# Altium schematic sheet 35-CSI-GPM-CDSS INTERFACE.SchDoc
size 513 x 386 mm
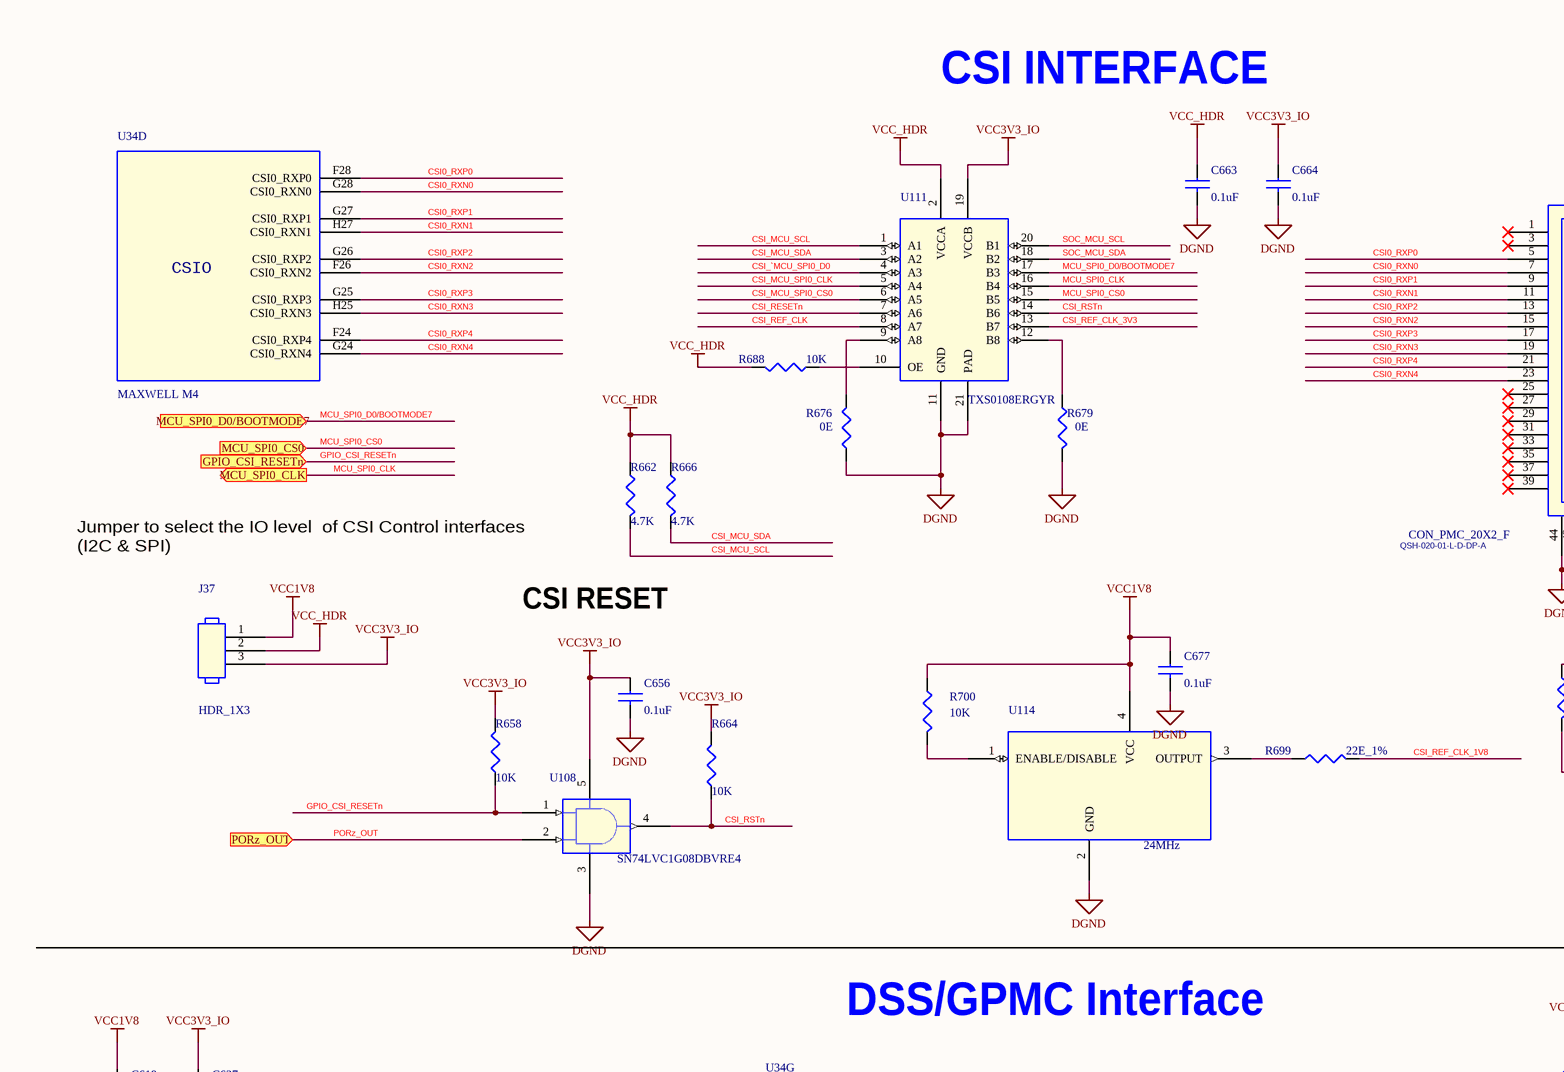
[diagram p0: 35-CSI-GPM-CDSS INTERFACE.SchDoc, top left]
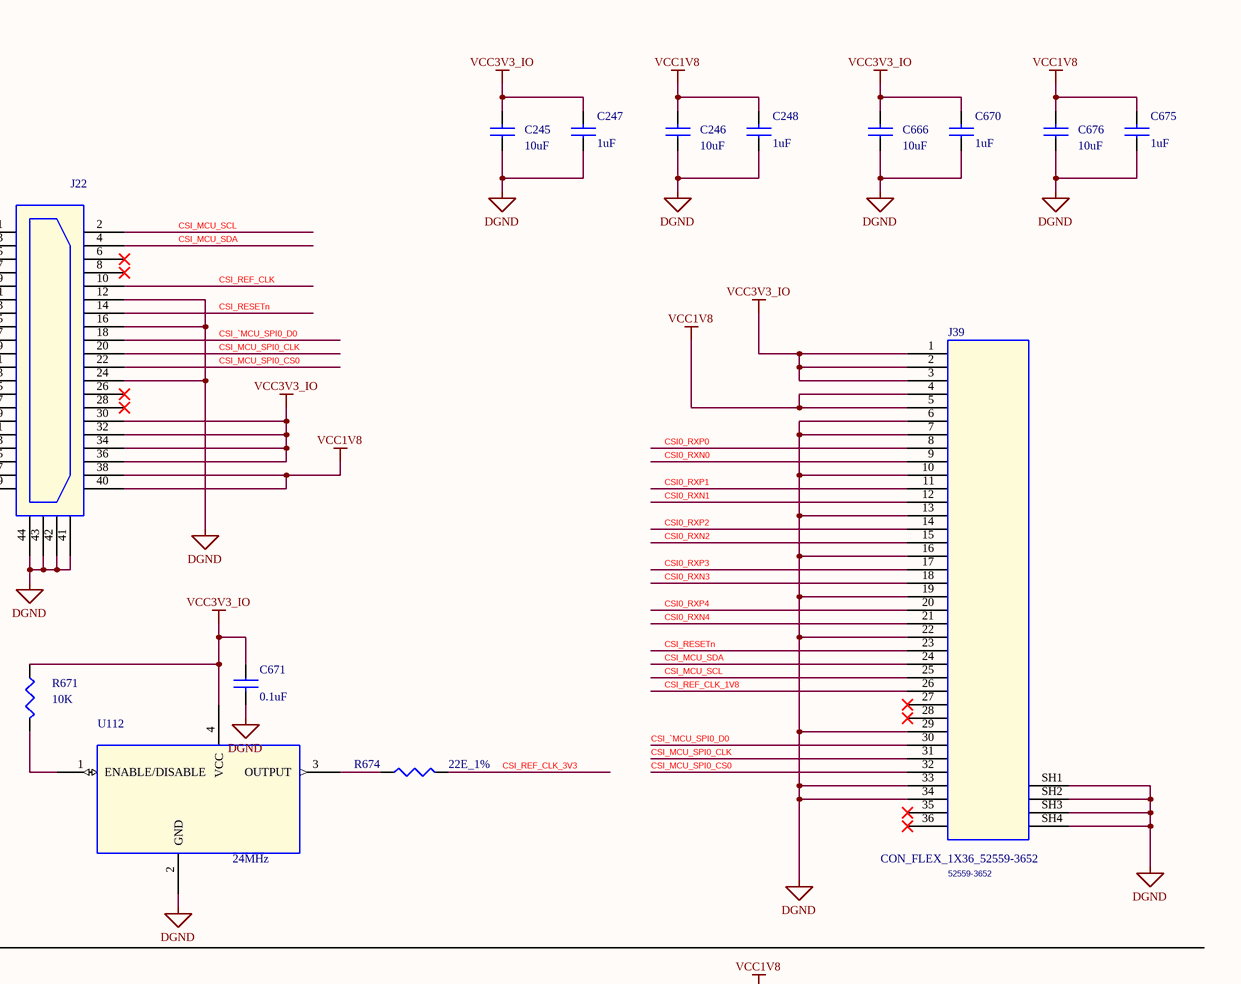
[diagram p1: 35-CSI-GPM-CDSS INTERFACE.SchDoc, top right]
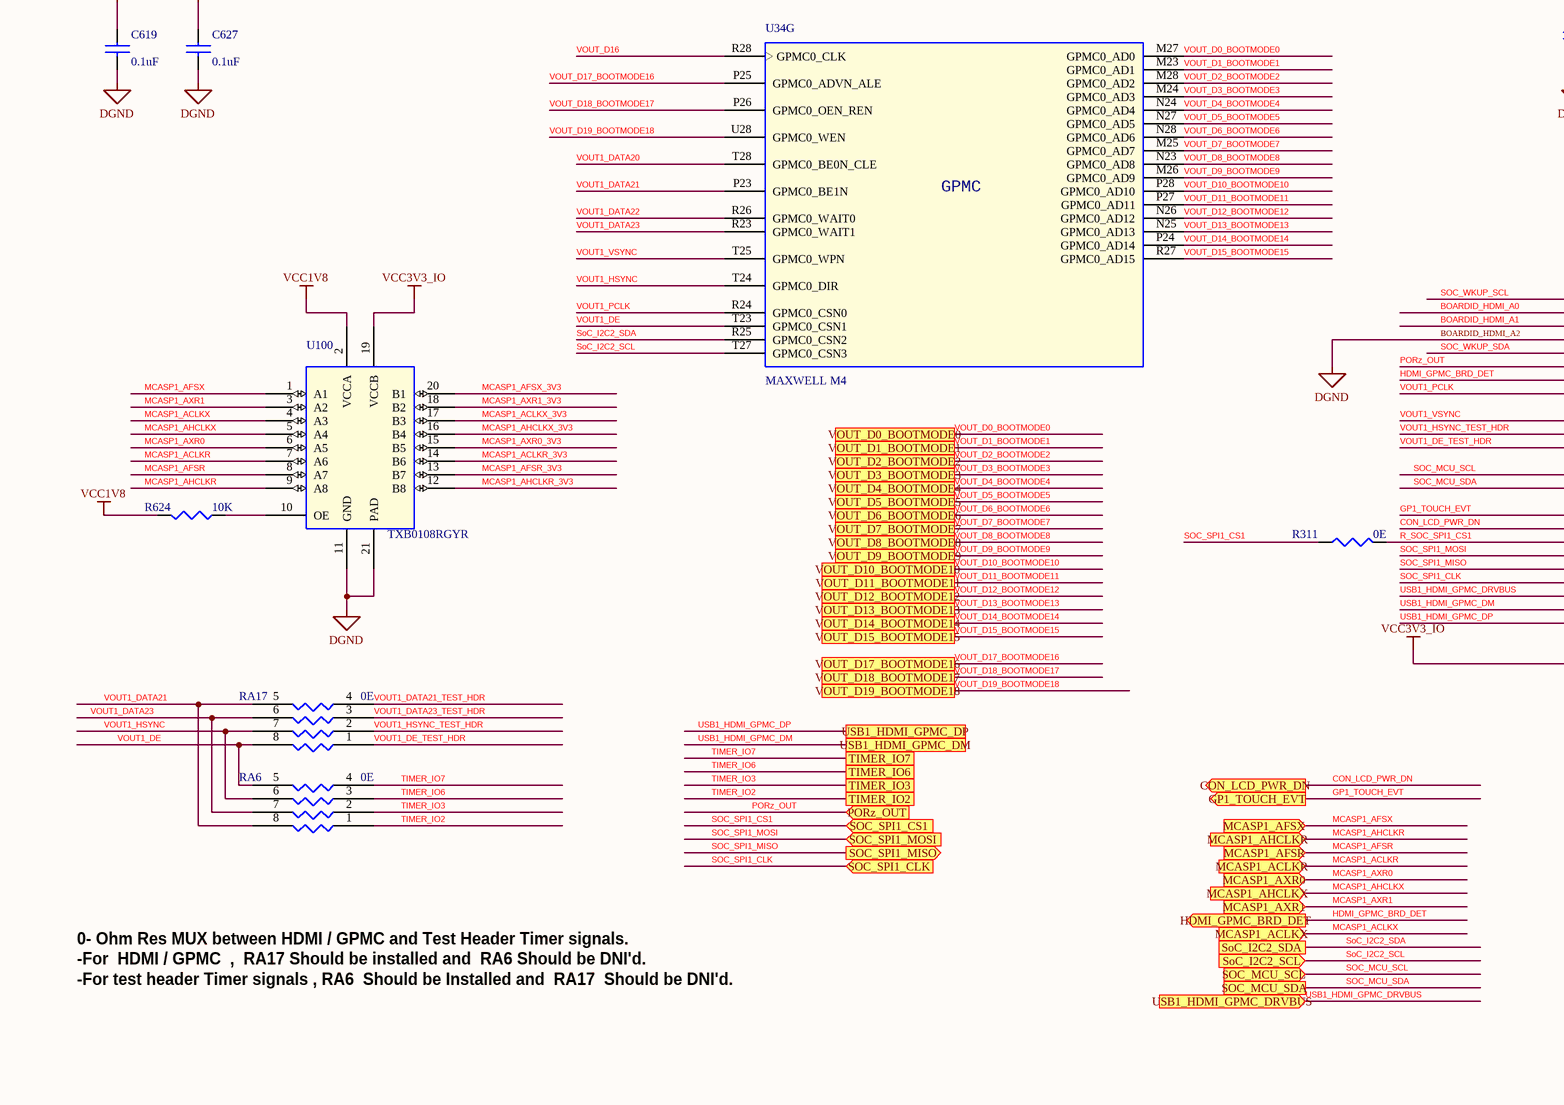
[diagram p2: 35-CSI-GPM-CDSS INTERFACE.SchDoc, bottom left]
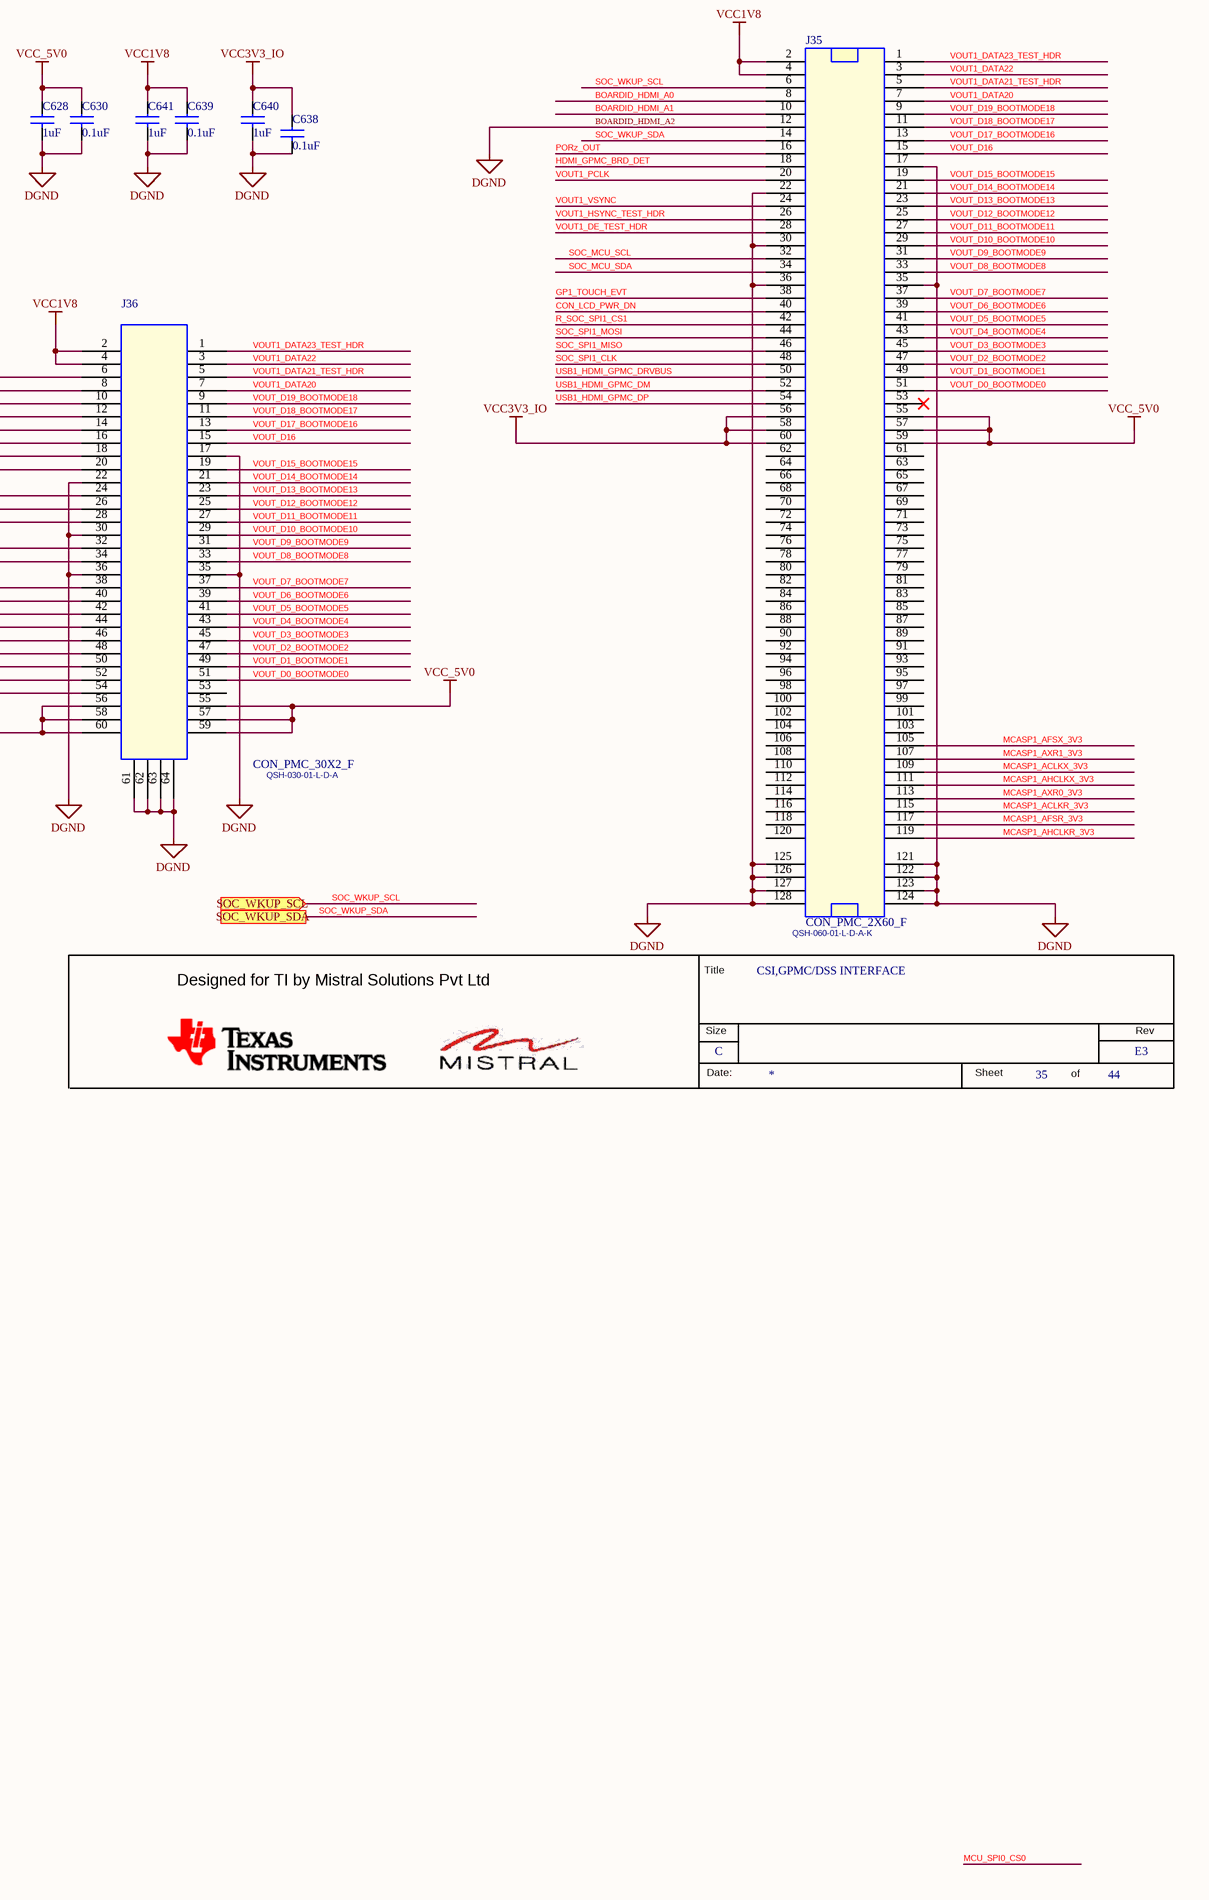
[diagram p3: 35-CSI-GPM-CDSS INTERFACE.SchDoc, bottom right]

## Parts
*  RevCode: E3  Title: CSI,GPMC/DSS INTERFACE  Page Size: C  Page Number: 35  Page Count: 44  (hidden comment: MISTRAL_TITLEBLK_CSIZE)  (graphical)
C245  10uF  [CAP0603_1]
C246  10uF  [CAP0603_1]
C247  1uF  [CAP0402_0-75]
C248  1uF  [CAP0402_0-75]
C619  0.1uF  [CAP0201_0-5]
C627  0.1uF  [CAP0201_0-5]
C628  1uF  [CAP0402_0-75]
C630  0.1uF  [CAP0201_0-5]
C638  0.1uF  [CAP0201_0-5]
C639  0.1uF  [CAP0201_0-5]
C640  1uF  [CAP0402_0-75]
C641  1uF  [CAP0402_0-75]
C656  0.1uF  [CAP0201_0-5]
C663  0.1uF  [CAP0201_0-5]
C664  0.1uF  [CAP0201_0-5]
C666  10uF  [CAP0603_1]
C670  1uF  [CAP0402_0-75]
C671  0.1uF  [CAP0201_0-5]
C675  1uF  [CAP0402_0-75]
C676  10uF  [CAP0603_1]
C677  0.1uF  [CAP0201_0-5]
J22  CON_PMC_20X2_F  Mfr_part_number: QSH-020-01-L-D-DP-A  [CON_PMC20X2_QSH-D-DP_S_S_S]
J35  CON_PMC_2X60_F  Mfr_part_number: QSH-060-01-L-D-A-K  [CON_PMC60X2_HQCD-060_S_S_S_3-3]
J36  CON_PMC_30X2_F  Mfr_part_number: QSH-030-01-L-D-A  [CON_PMC30X2_QSH-030-01-L_S_S_S]
J37  HDR_1X3  [HDR_3X1_100_S_T]
J39  CON_FLEX_1X36_52559-3652  Mfr_part_number: 52559-3652  [CON_FLEX1X36_52559-36_S_S_S_5-3]
R311  0E  [RES0402_0-5]
R624  10K  [RES0402_0-5]
R658  10K  [RES0402_0-5]
R662  4.7K  [RES0402]
R664  10K  [RES0402_0-5]
R666  4.7K  [RES0402]
R671  10K  [RES0402_0-5]
R674  22E_1%  [RES0402]
R676  0E  [RES0402_0-5]
R679  0E  [RES0402_0-5]
R688  10K  [RES0402_0-5]
R699  22E_1%  [RES0402]
R700  10K  [RES0402_0-5]
RA6  0E  [RESA_EXBN8V_0402-4_0-6]
RA17  0E  [RESA_EXBN8V_0402-4_0-6]
U34  MAXWELL M4  [BGA784_31-49_910X910_1-7]  (parts D,G of 19)
U100  TXB0108RGYR  [QFN20_19-68_185X145_1]
U108  SN74LVC1G08DBVRE4  [SOT23-5]
U111  TXS0108ERGYR  [QFN20_19-68_185X145_1]
U112  24MHz  [OSC4_KC2520B_100X80_SMD]
U114  24MHz  [OSC4_KC2520B_100X80_SMD]

## Ports
CON_LCD_PWR_DN (out), GP1_TOUCH_EVT (out), GPIO_CSI_RESETn (in), HDMI_GPMC_BRD_DET (out), MCASP1_ACLKR (in), MCASP1_ACLKX (in), MCASP1_AFSR (in), MCASP1_AFSX (in), MCASP1_AHCLKR (in), MCASP1_AHCLKX (in), MCASP1_AXR0 (in), MCASP1_AXR1 (in), MCU_SPI0_CLK (out), MCU_SPI0_CS0 (in), MCU_SPI0_D0/BOOTMODE7 (in), PORz_OUT (in), SoC_I2C2_SCL (in), SoC_I2C2_SDA, SOC_MCU_SCL (in), SOC_MCU_SDA, SOC_SPI1_CLK (in), SOC_SPI1_CS1 (in), SOC_SPI1_MISO (out), SOC_SPI1_MOSI (in), SOC_WKUP_SCL (in), SOC_WKUP_SDA, TIMER_IO2, TIMER_IO3, TIMER_IO6, TIMER_IO7, USB1_HDMI_GPMC_DM, USB1_HDMI_GPMC_DP, USB1_HDMI_GPMC_DRVBUS (in), VOUT_D0_BOOTMODE0, VOUT_D1_BOOTMODE1, VOUT_D2_BOOTMODE2, VOUT_D3_BOOTMODE3, VOUT_D4_BOOTMODE4, VOUT_D5_BOOTMODE5, VOUT_D6_BOOTMODE6, VOUT_D7_BOOTMODE7, VOUT_D8_BOOTMODE8, VOUT_D9_BOOTMODE9, VOUT_D10_BOOTMODE10, VOUT_D11_BOOTMODE11, VOUT_D12_BOOTMODE12, VOUT_D13_BOOTMODE13, VOUT_D14_BOOTMODE14, VOUT_D15_BOOTMODE15, VOUT_D17_BOOTMODE16, VOUT_D18_BOOTMODE17, VOUT_D19_BOOTMODE18

## Nets
DGND: C245.1 C246.1 C247.1 C248.1 C619.2 C627.2 C628.2 C630.2 C638.2 C639.2 C640.2 C641.2 C656.2 C663.2 C664.2 C666.1 C670.1 C671.2 C675.1 C676.1 C677.2 J22.12 J22.16 J22.24 J22.41(GND1) J22.42(GND2) J22.43(GND3) J22.44(GND4) J35.12 J35.17 J35.22 J35.30 J35.35 J35.36 J35.121 J35.122 J35.123 J35.124 J35.125 J35.126 J35.127 J35.128 J36.12 J36.17 J36.22 J36.30 J36.35 J36.36 J36.61 J36.62 J36.63 J36.64 J39.6 J39.7 J39.10 J39.13 J39.16 J39.19 J39.22 J39.29 J39.33 J39.34 J39.SH1 J39.SH2 J39.SH3 J39.SH4 R676.1 R679.1 U100.11(GND) U100.21(PAD) U108.3(GND) U111.11(GND) U111.21(PAD) U112.2(GND) U114.2(GND)
VCC1V8: C246.2 C248.2 C619.1 C639.1 C641.1 C675.2 C676.2 C677.1 J22.38 J22.40 J35.2 J35.4 J36.2 J36.4 J37.1 J39.4 J39.5 R624.2 R700.1 U100.2(VCCA) U114.4(VCC)
VCC3V3_IO: C245.2 C247.2 C627.1 C638.1 C640.1 C656.1 C664.1 C666.2 C670.2 C671.1 J22.30 J22.32 J22.34 J22.36 J35.56 J35.58 J35.60 J36.56 J36.58 J36.60 J37.3 J39.1 J39.2 J39.3 R658.2 R664.2 R671.1 U100.19(VCCB) U108.5(VCC) U111.19(VCCB) U112.4(VCC)
VCC_5V0: C628.1 C630.1 J35.55 J35.57 J35.59 J36.55 J36.57 J36.59
VCC_HDR: C663.1 J37.2 R662.1 R666.1 R688.2 U111.2(VCCA)
BOARDID_HDMI_A0: J35.8 J36.8
BOARDID_HDMI_A1: J35.10 J36.10
CON_LCD_PWR_DN: J35.40 J36.40 ; port CON_LCD_PWR_DN
CSI0_RXN0: J22.7 J39.9 U34.G28(CSI0_RXN0)
CSI0_RXN1: J22.11 J39.12 U34.H27(CSI0_RXN1)
CSI0_RXN2: J22.15 J39.15 U34.F26(CSI0_RXN2)
CSI0_RXN3: J22.19 J39.18 U34.H25(CSI0_RXN3)
CSI0_RXN4: J22.23 J39.21 U34.G24(CSI0_RXN4)
CSI0_RXP0: J22.5 J39.8 U34.F28(CSI0_RXP0)
CSI0_RXP1: J22.9 J39.11 U34.G27(CSI0_RXP1)
CSI0_RXP2: J22.13 J39.14 U34.G26(CSI0_RXP2)
CSI0_RXP3: J22.17 J39.17 U34.G25(CSI0_RXP3)
CSI0_RXP4: J22.21 J39.20 U34.F24(CSI0_RXP4)
CSI_`MCU_SPI0_D0: J22.18 J39.30 U111.4(A3)
CSI_MCU_SCL: J22.2 J39.25 R662.2 U111.1(A1)
CSI_MCU_SDA: J22.4 J39.24 R666.2 U111.3(A2)
CSI_MCU_SPI0_CLK: J22.20 J39.31 U111.5(A4)
CSI_MCU_SPI0_CS0: J22.22 J39.32 U111.6(A5)
CSI_REF_CLK: J22.10 U111.8(A7)
CSI_REF_CLK_1V8: J39.26 R699.2
CSI_REF_CLK_3V3: R674.2 U111.13(B7)
CSI_RESETn: J22.14 J39.23 U111.7(A6)
CSI_RSTn: R664.1 U108.4(Y) U111.14(B6)
GP1_TOUCH_EVT: J35.38 J36.38 ; port GP1_TOUCH_EVT
GPIO_CSI_RESETn: R658.1 U108.1(A) ; port GPIO_CSI_RESETn
HDMI_GPMC_BRD_DET: J35.18 J36.18 ; port HDMI_GPMC_BRD_DET
MCASP1_ACLKR: U100.7(A6) ; port MCASP1_ACLKR
MCASP1_ACLKR_3V3: J35.115 U100.14(B6)
MCASP1_ACLKX: U100.4(A3) ; port MCASP1_ACLKX
MCASP1_ACLKX_3V3: J35.109 U100.17(B3)
MCASP1_AFSR: U100.8(A7) ; port MCASP1_AFSR
MCASP1_AFSR_3V3: J35.117 U100.13(B7)
MCASP1_AFSX: U100.1(A1) ; port MCASP1_AFSX
MCASP1_AFSX_3V3: J35.105 U100.20(B1)
MCASP1_AHCLKR: U100.9(A8) ; port MCASP1_AHCLKR
MCASP1_AHCLKR_3V3: J35.119 U100.12(B8)
MCASP1_AHCLKX: U100.5(A4) ; port MCASP1_AHCLKX
MCASP1_AHCLKX_3V3: J35.111 U100.16(B4)
MCASP1_AXR0: U100.6(A5) ; port MCASP1_AXR0
MCASP1_AXR0_3V3: J35.113 U100.15(B5)
MCASP1_AXR1: U100.3(A2) ; port MCASP1_AXR1
MCASP1_AXR1_3V3: J35.107 U100.18(B2)
MCU_SPI0_CLK: U111.16(B4) ; port MCU_SPI0_CLK
MCU_SPI0_CS0: U111.15(B5) ; port MCU_SPI0_CS0
MCU_SPI0_D0/BOOTMODE7: U111.17(B3) ; port MCU_SPI0_D0/BOOTMODE7
PORz_OUT: J35.16 J36.16 U108.2(B) ; port PORz_OUT
R_SOC_SPI1_CS1: J35.42 J36.42 R311.2
SoC_I2C2_SCL: U34.T27(GPMC0_CSN3) ; port SoC_I2C2_SCL
SoC_I2C2_SDA: U34.R25(GPMC0_CSN2) ; port SoC_I2C2_SDA
SOC_MCU_SCL: J35.32 J36.32 U111.20(B1) ; port SOC_MCU_SCL
SOC_MCU_SDA: J35.34 J36.34 U111.18(B2) ; port SOC_MCU_SDA
SOC_SPI1_CLK: J35.48 J36.48 ; port SOC_SPI1_CLK
SOC_SPI1_CS1: R311.1 ; port SOC_SPI1_CS1
SOC_SPI1_MISO: J35.46 J36.46 ; port SOC_SPI1_MISO
SOC_SPI1_MOSI: J35.44 J36.44 ; port SOC_SPI1_MOSI
SOC_WKUP_SCL: J35.6 J36.6 ; port SOC_WKUP_SCL
SOC_WKUP_SDA: J35.14 J36.14 ; port SOC_WKUP_SDA
TIMER_IO2: RA6.1 ; port TIMER_IO2
TIMER_IO3: RA6.2 ; port TIMER_IO3
TIMER_IO6: RA6.3 ; port TIMER_IO6
TIMER_IO7: RA6.4 ; port TIMER_IO7
USB1_HDMI_GPMC_DM: J35.52 J36.52 ; port USB1_HDMI_GPMC_DM
USB1_HDMI_GPMC_DP: J35.54 J36.54 ; port USB1_HDMI_GPMC_DP
USB1_HDMI_GPMC_DRVBUS: J35.50 J36.50 ; port USB1_HDMI_GPMC_DRVBUS
VOUT1_DATA20: J35.7 J36.7 U34.T28(GPMC0_BE0N_CLE)
VOUT1_DATA21: RA6.8 RA17.5 U34.P23(GPMC0_BE1N)
VOUT1_DATA21_TEST_HDR: J35.5 J36.5 RA17.4
VOUT1_DATA22: J35.3 J36.3 U34.R26(GPMC0_WAIT0)
VOUT1_DATA23: RA6.7 RA17.6 U34.R23(GPMC0_WAIT1)
VOUT1_DATA23_TEST_HDR: J35.1 J36.1 RA17.3
VOUT1_DE: RA6.5 RA17.8 U34.T23(GPMC0_CSN1)
VOUT1_DE_TEST_HDR: J35.28 J36.28 RA17.1
VOUT1_HSYNC: RA6.6 RA17.7 U34.T24(GPMC0_DIR)
VOUT1_HSYNC_TEST_HDR: J35.26 J36.26 RA17.2
VOUT1_PCLK: J35.20 J36.20 U34.R24(GPMC0_CSN0)
VOUT1_VSYNC: J35.24 J36.24 U34.T25(GPMC0_WPN)
VOUT_D0_BOOTMODE0: J35.51 J36.51 U34.M27(GPMC0_AD0) ; port VOUT_D0_BOOTMODE0
VOUT_D1_BOOTMODE1: J35.49 J36.49 U34.M23(GPMC0_AD1) ; port VOUT_D1_BOOTMODE1
VOUT_D2_BOOTMODE2: J35.47 J36.47 U34.M28(GPMC0_AD2) ; port VOUT_D2_BOOTMODE2
VOUT_D3_BOOTMODE3: J35.45 J36.45 U34.M24(GPMC0_AD3) ; port VOUT_D3_BOOTMODE3
VOUT_D4_BOOTMODE4: J35.43 J36.43 U34.N24(GPMC0_AD4) ; port VOUT_D4_BOOTMODE4
VOUT_D5_BOOTMODE5: J35.41 J36.41 U34.N27(GPMC0_AD5) ; port VOUT_D5_BOOTMODE5
VOUT_D6_BOOTMODE6: J35.39 J36.39 U34.N28(GPMC0_AD6) ; port VOUT_D6_BOOTMODE6
VOUT_D7_BOOTMODE7: J35.37 J36.37 U34.M25(GPMC0_AD7) ; port VOUT_D7_BOOTMODE7
VOUT_D8_BOOTMODE8: J35.33 J36.33 U34.N23(GPMC0_AD8) ; port VOUT_D8_BOOTMODE8
VOUT_D9_BOOTMODE9: J35.31 J36.31 U34.M26(GPMC0_AD9) ; port VOUT_D9_BOOTMODE9
VOUT_D10_BOOTMODE10: J35.29 J36.29 U34.P28(GPMC0_AD10) ; port VOUT_D10_BOOTMODE10
VOUT_D11_BOOTMODE11: J35.27 J36.27 U34.P27(GPMC0_AD11) ; port VOUT_D11_BOOTMODE11
VOUT_D12_BOOTMODE12: J35.25 J36.25 U34.N26(GPMC0_AD12) ; port VOUT_D12_BOOTMODE12
VOUT_D13_BOOTMODE13: J35.23 J36.23 U34.N25(GPMC0_AD13) ; port VOUT_D13_BOOTMODE13
VOUT_D14_BOOTMODE14: J35.21 J36.21 U34.P24(GPMC0_AD14) ; port VOUT_D14_BOOTMODE14
VOUT_D15_BOOTMODE15: J35.19 J36.19 U34.R27(GPMC0_AD15) ; port VOUT_D15_BOOTMODE15
VOUT_D16: J35.15 J36.15 U34.R28(GPMC0_CLK)
VOUT_D17_BOOTMODE16: J35.13 J36.13 U34.P25(GPMC0_ADVN_ALE) ; port VOUT_D17_BOOTMODE16
VOUT_D18_BOOTMODE17: J35.11 J36.11 U34.P26(GPMC0_OEN_REN) ; port VOUT_D18_BOOTMODE17
VOUT_D19_BOOTMODE18: J35.9 J36.9 U34.U28(GPMC0_WEN) ; port VOUT_D19_BOOTMODE18
NetR624_1: R624.1 U100.10(OE)
NetR671_2: R671.2 U112.1(ENABLE/DISABLE)
NetR674_1: R674.1 U112.3(OUTPUT)
NetR676_2: R676.2 U111.9(A8)
NetR679_2: R679.2 U111.12(B8)
NetR688_1: R688.1 U111.10(OE)
NetR699_1: R699.1 U114.3(OUTPUT)
NetR700_2: R700.2 U114.1(ENABLE/DISABLE)

Not connected (* = marked no-connect by the designer): J22 1* 3* 6* 8* 25* 26* 27* 28* 29* 31* 33* 35* 37* 39*; J35 53* 61 62 63 64 65 66 67 68 69 70 71 72 73 74 75 76 77 78 79 80 81 82 83 84 85 86 87 88 89 90 91 92 93 94 95 96 97 98 99 100 101 102 103 104 106 108 110 112 114 116 118 120; J36 53; J39 27* 28* 35* 36*

## Notes on the sheet
- CSI INTERFACE
- Jumper to select the IO level  of CSI Control interfaces
  (I2C & SPI)
- CSI RESET
- DSS/GPMC Interface
- BOARDID_HDMI_A2
- 0- Ohm Res MUX between HDMI / GPMC and Test Header Timer signals.
  -For  HDMI / GPMC  ,  RA17 Should be installed and  RA6 Should be DNI'd.
  -For test header Timer signals , RA6  Should be Installed and  RA17  Should be DNI'd.
- (in symbol AM654X_BGA784, part D) CSIO
- (in symbol AM654X_BGA784, part G) GPMC
- (in symbol MISTRAL_TITLEBLK_CSIZE) Title; Designed for TI by Mistral Solutions Pvt Ltd; Size; Rev; Date:; Sheet; of

## Library data of the parts
* = MISTRAL_TITLEBLK_CSIZE: Issue: 1.0; Page Create Date: March  8, 1995; Page Modify Date: *
C245 C666 = CAP_Dup5: CAP CERAMIC 10uF 10V 10% X5R 0603; Mistral Part No: 120010080001-R; Mfr_name: AVX CORPORATION; Mfr_part_number: 0603ZD106KAT2A; Part_type: CAPACITORS\CERAMIC; Wattage: NA; Project: TI_MAXIE_CPB; Customs_HS_Code: 85322990; Custom_Duty: 15%; MECHANICAL 3D STEP FILE: CAP0603_1; Temperature: -55°C+85°C; Weight: 2mg; PCB Footprint: CAP0603_1; Tolerance: 10%; Voltage: 10V; Package: 0603; Distributor_name: DIGIKEY; Distributor_part_number: 478-10766-1-ND; Height: 0.94MM; Datasheet: Y:\MIS_DATABASE\DATASHEETS\CAPACITORS\AVX_MLC.PDF; Crtd /date: MANIRAJA/230118; Chkd/date: MANIRAJA/230118; Library Ref: CAP
C246 C676 = CAP_Dup5: CAP CERAMIC 10uF 10V 10% X5R 0603; Part_type: CAPACITORS\CERAMIC; Mfr_part_number: 0603ZD106KAT2A; Mfr_name: AVX CORPORATION; Mistral Part No: 120010080001-R; Wattage: NA; Custom_Duty: 15%; Customs_HS_Code: 85322990; Project: TI_MAXIE_CPB; MECHANICAL 3D STEP FILE: CAP0603_1; Temperature: -55°C+85°C; Weight: 2mg; PCB Footprint: CAP0603_1; Chkd/date: MANIRAJA/230118; Crtd /date: MANIRAJA/230118; Datasheet: Y:\MIS_DATABASE\DATASHEETS\CAPACITORS\AVX_MLC.PDF; Height: 0.94MM; Distributor_part_number: 478-10766-1-ND; Distributor_name: DIGIKEY; Package: 0603; Voltage: 10V; Tolerance: 10%; Library Ref: CAP
C247 C670 = CAP_Dup5: CAP CERAMIC 1uF 16V 20% X5R 0402; Part_type: CAPACITORS\CERAMIC; Mfr_part_number: EMK105BJ105MV-F; Mfr_name: TAIYO YUDEN; Mistral Part No: 120018020006-R; Custom_Duty: 15%; Customs_HS_Code: 85322990; Wattage: NA; Project: TI_MAXIE_CPB; Chkd/date: MANIRAJA/150218; Crtd /date: ALVY/150218; Datasheet: Y:\MIS_DATABASE\DATASHEETS\CAPACITORS\EMK105BJ105MV-F.PDF; Temperature: -55°C+85°C; Weight: 0.65mg; Height: 0.55MM; Distributor_part_number: 587-5514-1-ND; Distributor_name: DIGIKEY; Package: 0402; Voltage: 16V; Tolerance: 20%; PCB Footprint: CAP0402_0-75; MECHANICAL 3D STEP FILE: CAP0402_0-75; Library Path: Y:\MIS_DATABASE\Library\ALTIUM_TOOL\SCHEMATICS_PARTS\MS_DISCRETE_Library.schlib; Footprint Path: Y:\MIS_DATABASE\Library\ALTIUM_TOOL\PCB_FOOTPRINTS\Altium_Footprint_Lib.PcbLib; Library Ref: CAP; Footprint Ref: CAP0402_0-75
C248 C675 = CAP_Dup5: CAP CERAMIC 1uF 16V 20% X5R 0402; Mistral Part No: 120018020006-R; Mfr_name: TAIYO YUDEN; Mfr_part_number: EMK105BJ105MV-F; Part_type: CAPACITORS\CERAMIC; Project: TI_MAXIE_CPB; Wattage: NA; Customs_HS_Code: 85322990; Custom_Duty: 15%; Tolerance: 20%; Voltage: 16V; Package: 0402; Distributor_name: DIGIKEY; Distributor_part_number: 587-5514-1-ND; Height: 0.55MM; Weight: 0.65mg; Temperature: -55°C+85°C; Datasheet: Y:\MIS_DATABASE\DATASHEETS\CAPACITORS\EMK105BJ105MV-F.PDF; Crtd /date: ALVY/150218; Chkd/date: MANIRAJA/150218; PCB Footprint: CAP0402_0-75; MECHANICAL 3D STEP FILE: CAP0402_0-75; Library Path: Y:\MIS_DATABASE\Library\ALTIUM_TOOL\SCHEMATICS_PARTS\MS_DISCRETE_Library.schlib; Footprint Path: Y:\MIS_DATABASE\Library\ALTIUM_TOOL\PCB_FOOTPRINTS\Altium_Footprint_Lib.PcbLib; Library Ref: CAP; Footprint Ref: CAP0402_0-75
C619 C627 C630 C656 C663 C664 = CAP_Dup5: CAP CERAMIC 0.1uF 16V 10% X5R 0201; Mistral Part No: 120009030072-R; Mfr_name: MURATA; Mfr_part_number: GRM033R61C104KE84J; Part_type: CAPACITORS\CERAMIC; Project: TI_MAXIE_CPB; Wattage: NA; Customs_HS_Code: 85322990; Custom_Duty: 15%; Tolerance: 10%; Voltage: 16V; Package: 0201; Distributor_name: DIGIKEY; Distributor_part_number: 490-16742-1-ND; Height: 0.33MM; Weight: 0.33mg; Temperature: -55°C+85°C; Datasheet: Y:\MIS_DATABASE\DATASHEETS\CAPACITORS\GRM033R61C104KE84.PDF; Crtd /date: MANIRAJA/120218; Chkd/date: MANIRAJA/120218; MECHANICAL 3D STEP FILE: CAP0201_0-5; PCB Footprint: CAP0201_0-5; Library Ref: CAP
C628 C640 = CAP_Dup5: CAP CERAMIC 1uF 16V 20% X5R 0402; Part_type: CAPACITORS\CERAMIC; Mfr_part_number: EMK105BJ105MV-F; Mfr_name: TAIYO YUDEN; Mistral Part No: 120018020006-R; Custom_Duty: 15%; Customs_HS_Code: 85322990; Project: TI_MAXIE_CPB; Wattage: NA; Chkd/date: MANIRAJA/150218; Crtd /date: ALVY/150218; Datasheet: Y:\MIS_DATABASE\DATASHEETS\CAPACITORS\EMK105BJ105MV-F.PDF; Temperature: -55°C+85°C; Weight: 0.65mg; Height: 0.55MM; Distributor_part_number: 587-5514-1-ND; Distributor_name: DIGIKEY; Package: 0402; Voltage: 16V; Tolerance: 20%; PCB Footprint: CAP0402_0-75; MECHANICAL 3D STEP FILE: CAP0402_0-75; Library Path: Y:\MIS_DATABASE\Library\ALTIUM_TOOL\SCHEMATICS_PARTS\MS_DISCRETE_Library.schlib; Footprint Path: Y:\MIS_DATABASE\Library\ALTIUM_TOOL\PCB_FOOTPRINTS\Altium_Footprint_Lib.PcbLib; Library Ref: CAP; Footprint Ref: CAP0402_0-75
C638 C639 = CAP_Dup5: CAP CERAMIC 0.1uF 16V 10% X5R 0201; Part_type: CAPACITORS\CERAMIC; Mfr_part_number: GRM033R61C104KE84J; Mfr_name: MURATA; Mistral Part No: 120009030072-R; Custom_Duty: 15%; Customs_HS_Code: 85322990; Wattage: NA; Project: TI_MAXIE_CPB; MECHANICAL 3D STEP FILE: CAP0201_0-5; Chkd/date: MANIRAJA/120218; Crtd /date: MANIRAJA/120218; Datasheet: Y:\MIS_DATABASE\DATASHEETS\CAPACITORS\GRM033R61C104KE84.PDF; Temperature: -55°C+85°C; Weight: 0.33mg; Height: 0.33MM; Distributor_part_number: 490-16742-1-ND; Distributor_name: DIGIKEY; Package: 0201; Voltage: 16V; Tolerance: 10%; PCB Footprint: CAP0201_0-5; Library Ref: CAP
C641 = CAP_Dup5: CAP CERAMIC 1uF 16V 20% X5R 0402; Mistral Part No: 120018020006-R; Mfr_name: TAIYO YUDEN; Mfr_part_number: EMK105BJ105MV-F; Part_type: CAPACITORS\CERAMIC; Project: TI_MAXIE_CPB; Customs_HS_Code: 85322990; Custom_Duty: 15%; Wattage: NA; Tolerance: 20%; Voltage: 16V; Package: 0402; Distributor_name: DIGIKEY; Distributor_part_number: 587-5514-1-ND; Height: 0.55MM; Weight: 0.65mg; Temperature: -55°C+85°C; Datasheet: Y:\MIS_DATABASE\DATASHEETS\CAPACITORS\EMK105BJ105MV-F.PDF; Crtd /date: ALVY/150218; Chkd/date: MANIRAJA/150218; PCB Footprint: CAP0402_0-75; MECHANICAL 3D STEP FILE: CAP0402_0-75; Library Path: Y:\MIS_DATABASE\Library\ALTIUM_TOOL\SCHEMATICS_PARTS\MS_DISCRETE_Library.schlib; Footprint Path: Y:\MIS_DATABASE\Library\ALTIUM_TOOL\PCB_FOOTPRINTS\Altium_Footprint_Lib.PcbLib; Library Ref: CAP; Footprint Ref: CAP0402_0-75
C671 C677 = CAP_Dup5: CAP CERAMIC 0.1uF 16V 10% X5R 0201; Mistral Part No: 120009030072-R; Mfr_name: MURATA; Mfr_part_number: GRM033R61C104KE84J; Part_type: CAPACITORS\CERAMIC; Project: TI_MAXIE_CPB; Wattage: NA; Customs_HS_Code: 85322990; Custom_Duty: 15%; NI_MARK: DNI; Tolerance: 10%; Voltage: 16V; Package: 0201; Distributor_name: DIGIKEY; Distributor_part_number: 490-16742-1-ND; Height: 0.33MM; Weight: 0.33mg; Temperature: -55°C+85°C; Datasheet: Y:\MIS_DATABASE\DATASHEETS\CAPACITORS\GRM033R61C104KE84.PDF; Crtd /date: MANIRAJA/120218; Chkd/date: MANIRAJA/120218; MECHANICAL 3D STEP FILE: CAP0201_0-5; PCB Footprint: CAP0201_0-5; Library Ref: CAP
J22 = CON_PMC_20X2_F: CON PMC 20X2 0.50MM PITCH FEMALE ST SMD; Part_type: CONNECTOR\PMC; Mfr_name: SAMTEC; Mistral Part No: 150011110006-R; Custom_Duty: 24%; Customs_HS_Code: 85369090; Wattage: NA; Project: LLTR; Chkd/date: USMAN/021214; Crtd /date: CHAITHANYA/031111; Datasheet: Y:\MIS_DATABASE\DATASHEETS\CONNECTORS\QSH-SERIES.PDF; Temperature: -55°C+125°C; Weight: NA; Height: 3.25MM; Distributor_part_number: QSH-020-01-L-D-DP-A-ND; Distributor_name: DIGIKEY; Package: SMD; Voltage: NA; Tolerance: NA; PCB Footprint: CON_PMC20X2_QSH-D-DP_S_S_S; Library Ref: CON_PMC_20X2_F
J35 = CON_PMC_60X2_HQCD: CON PMC 2X60 0.50MM PITCH FEMALE ST SMD; Mistral Part No: 150010060004-R; Mfr_name: SAMTEC; Part_type: CONNECTOR\PMC; Project: CENTAURUS; Tolerance: NA; Customs_HS_Code: 85369090; Custom_Duty: 24%; NI_MARK: DNI; PCB Footprint: CON_PMC60X2_HQCD-060_S_S_S_3-3; Voltage: NA; Wattage: NA; Package: SMD; Distributor_name: DIGIKEY; Distributor_part_number: SAM10652-ND; Height: 3.25MM; Weight: NA; Temperature: -55°C+125°C; Datasheet: Y:\MIS_DATABASE\DATASHEETS\CONNECTORS\QSH.PDF; Crtd /date: MUDDU/020610; Chkd/date: MANIRAJA/230817; MECHANICAL 3D STEP FILE: CON_PMC60X2_HQCD-060_S_S_S_3-3; Library Ref: CON_PMC_60X2_HQCD
J36 = CON_PMC_30X2_F_Dup1: CON PMC 30X2 0.50MM PITCH FEMALE ST SMD; Part_type: CONNECTOR\PMC; Mfr_name: SAMTEC; Mistral Part No: 150009030606; Custom_Duty: 24%; Customs_HS_Code: 85369090; Project: KHAN_HSST; PCB Footprint: CON_PMC30X2_QSH-030-01-L_S_S_S; Chkd/date: MAZHAR/180208; Crtd /date: USMAN/051108; Datasheet: Y:\MIS_DATABASE\DATASHEETS\CONNECTORS\QSH.PDF; Height: 3.25MM; Package: SMD; Library Ref: CON_PMC_30X2_F
J37 = HEADER_3X1: HDR 1X3 2.54MM PITCH ST TH; Part_type: CONNECTOR\HEADERS; Mfr_part_number: 68001-403HLF; Mfr_name: FCI; Mistral Part No: 150016060025-R; Custom_Duty: 15%; Customs_HS_Code: 85322990; Wattage: NA; Project: IKEYP; Chkd/date: VASANTHA/290616; Crtd /date: VASANTHA/290616; Datasheet: Y:\MIS_DATABASE\DATASHEETS\CONNECTORS\68000.PDF; Temperature: -40°C+105°C; Weight: NA; Height: 8.58MM; Distributor_part_number: 609-3471-ND; Distributor_name: DIGIKEY; Package: THRU-HOLE; Voltage: NA; Tolerance: NA; PCB Footprint: HDR_3X1_100_S_T; Library Ref: HEADER_3X1
J39 = CON_FLEX_36X1_52559-3652: CON FPC 1X36 0.50MM PITCH ST SMD; Mistral Part No: 150017090006-R; Mfr_name: MOLEX; Part_type: CONNECTOR\FPC; Project: TI_SVB_MAXWELL_DUT; Tolerance: NA; Customs_HS_Code: 85369090; Custom_Duty: 24%; Voltage: NA; Wattage: NA; Package: SMD; Distributor_name: DIGIKEY; Distributor_part_number: WM7988CT-ND; Height: 5.30MM; Weight: 429.23mg; Temperature: -40°C+85°C; Datasheet: Y:\MIS_DATABASE\DATASHEETS\CONNECTORS\52559.PDF; Crtd /date: MANIRAJA/060917; Chkd/date: MANIRAJA/060917; MECHANICAL 3D STEP FILE: CON_FLEX1X36_52559-36_S_S_S_5-3; PCB Footprint: CON_FLEX1X36_52559-36_S_S_S_5-3; Library Ref: CON_FLEX_36X1_52559-3652
R311 R679 = RESISTOR_Dup5: RES 0E 1/16W 0402; Mistral Part No: 110010080019-P; Mfr_name: VISHAY; Mfr_part_number: CRCW04020000Z0ED; Part_type: RESISTORS\FIXED; Project: PB_BUGBASE; Tolerance: NA; Customs_HS_Code: 85332119; Custom_Duty: 15%; Voltage: NA; Wattage: 1/16W; Package: 0402; Distributor_name: DIGIKEY; Distributor_part_number: 541-0.0JCT-ND; Height: 0.40MM; Weight: 0.65g/1000pcs; Temperature: -55°C+155°C; Datasheet: Y:\MIS_DATABASE\DATASHEETS\RESISTORS\CRCW0603.PDF; Crtd /date: MUDDU/190810; Chkd/date: VASANTHA/201216; RoHS: Pb-Free; MECHANICAL 3D STEP FILE: RES0402_0-5; PCB Footprint: RES0402_0-5; Library Ref: RESISTOR; Footprint Ref: RES0402_0-5; Library Path: Y:\MIS_DATABASE\Library\ALTIUM_TOOL\SCHEMATICS_PARTS\MS_DISCRETE_Library.schlib; Footprint Path: Y:\MIS_DATABASE\Library\ALTIUM_TOOL\PCB_FOOTPRINTS\Altium_Footprint_Lib.PcbLib
R624 R658 R664 R688 = RESISTOR_Dup5: RES 10K 1/16W 5% 0402; Part_type: RESISTORS\FIXED; Mfr_part_number: RC0402JR-0710KL; Mfr_name: YAGEO AMERICA; Mistral Part No: 110009030208-R; Custom_Duty: 15%; Customs_HS_Code: 85332119; Voltage: NA; Project: HSE; MECHANICAL 3D STEP FILE: RES0402_0-5; RoHS: Pb-Free; Chkd/date: VASANTHA/061216; Crtd /date: MAZHAR/230805; Datasheet: Y:\MIS_DATABASE\DATASHEETS\RESISTORS\YAGEO-RC0402.PDF; Temperature: -55°C+155°C; Weight: 0.65mg; Height: 0.40MM; Distributor_part_number: 311-10KJRCT-ND; Distributor_name: DIGIKEY; Package: 0402; Wattage: 1/16W; Tolerance: 5%; PCB Footprint: RES0402_0-5; Library Ref: RESISTOR; Footprint Ref: RES0402_0-5; Library Path: Y:\MIS_DATABASE\Library\ALTIUM_TOOL\SCHEMATICS_PARTS\MS_DISCRETE_Library.schlib; Footprint Path: Y:\MIS_DATABASE\Library\ALTIUM_TOOL\PCB_FOOTPRINTS\Altium_Footprint_Lib.PcbLib
R662 R666 = RESISTOR_Dup3: RES 4.7K 1/16W 5% 0402; Part_type: RESISTORS\FIXED; Mfr_part_number: RC0402JR-074K7L; Mfr_name: YAGEO AMERICA; Mistral Part No: 110009030792-R; Custom_Duty: 15%; Customs_HS_Code: 85332119; Voltage: NA; Project: TMDXCSK368; Chkd/date: VASANTHA/130516; Crtd /date: VASANTHA/130516; Datasheet: Y:\MIS_DATABASE\DATASHEETS\RESISTORS\YAGEO-RC0402.PDF; Temperature: -55°C+155°C; Weight: NA; Height: 0.55MM; Distributor_part_number: 311-4.7KJRCT-ND; Distributor_name: DIGIKEY; Package: 0402; Wattage: 1/16W; Tolerance: 5%; PCB Footprint: RES0402; Library Ref: RESISTOR
R671 R700 = RESISTOR_Dup5: RES 10K 1/16W 5% 0402; Mistral Part No: 110009030208-R; Mfr_name: YAGEO AMERICA; Mfr_part_number: RC0402JR-0710KL; Part_type: RESISTORS\FIXED; Project: HSE; Voltage: NA; Customs_HS_Code: 85332119; Custom_Duty: 15%; NI_MARK: DNI; Tolerance: 5%; Wattage: 1/16W; Package: 0402; Distributor_name: DIGIKEY; Distributor_part_number: 311-10KJRCT-ND; Height: 0.40MM; Weight: 0.65mg; Temperature: -55°C+155°C; Datasheet: Y:\MIS_DATABASE\DATASHEETS\RESISTORS\YAGEO-RC0402.PDF; Crtd /date: MAZHAR/230805; Chkd/date: VASANTHA/061216; RoHS: Pb-Free; MECHANICAL 3D STEP FILE: RES0402_0-5; PCB Footprint: RES0402_0-5; Library Ref: RESISTOR; Footprint Ref: RES0402_0-5; Library Path: Y:\MIS_DATABASE\Library\ALTIUM_TOOL\SCHEMATICS_PARTS\MS_DISCRETE_Library.schlib; Footprint Path: Y:\MIS_DATABASE\Library\ALTIUM_TOOL\PCB_FOOTPRINTS\Altium_Footprint_Lib.PcbLib
R674 = RESISTOR_Dup4: RES 22E 1/16W 1% 0402; Cust_part_number: 4700-80047E; Alternate_mfr_part_number_A: CRCW040222R0FKED; Alternate_mfr_name_A: VISHAY; Part_type: RESISTORS\FIXED; Mfr_part_number: RC0402FR-0722RL; Mfr_name: YAGEO AMERICA; Mistral Part No: 110009090004-P; Remarks: In alternate datasheet it is RoHS COMPLIANT. Y:\MIS_DATABASE\DATASHEETS\RESISTORS\CRCW0402.PDF; Custom_Duty: 15%; Customs_HS_Code: 85332119; Voltage: 50V; Project: VMEFMCD; SIGNAL_MODEL: RESISTOR_RES0402_22E_22E; NI_MARK: DNI; RoHS: Pb-Free; Chkd/date: SUHAS/290910; Crtd /date: MAZHAR/090909; Datasheet: Y:\MIS_DATABASE\DATASHEETS\RESISTORS\YAGEO-RC0402.PDF; Temperature: -55°C+155°C; Weight: 0.8g/1000pcs; Height: 0.40MM; Distributor_part_number_A: 541-22.0LCT-ND; Distributor_name_A: DIGIKEY; Distributor_part_number: 311-22.0LRCT-ND; Distributor_name: DIGIKEY; Package: 0402; Wattage: 1/16W; Tolerance: 1%; PCB Footprint: RES0402; Library Ref: RESISTOR
R676 = RESISTOR_Dup5: RES 0E 1/16W 0402; Part_type: RESISTORS\FIXED; Mfr_part_number: CRCW04020000Z0ED; Mfr_name: VISHAY; Mistral Part No: 110010080019-P; Custom_Duty: 15%; Customs_HS_Code: 85332119; Voltage: NA; Project: PB_BUGBASE; MECHANICAL 3D STEP FILE: RES0402_0-5; RoHS: Pb-Free; Chkd/date: VASANTHA/201216; Crtd /date: MUDDU/190810; Datasheet: Y:\MIS_DATABASE\DATASHEETS\RESISTORS\CRCW0603.PDF; Temperature: -55°C+155°C; Weight: 0.65g/1000pcs; Height: 0.40MM; Distributor_part_number: 541-0.0JCT-ND; Distributor_name: DIGIKEY; Package: 0402; Wattage: 1/16W; Tolerance: NA; PCB Footprint: RES0402_0-5; Library Ref: RESISTOR; Footprint Ref: RES0402_0-5; Library Path: Y:\MIS_DATABASE\Library\ALTIUM_TOOL\SCHEMATICS_PARTS\MS_DISCRETE_Library.schlib; Footprint Path: Y:\MIS_DATABASE\Library\ALTIUM_TOOL\PCB_FOOTPRINTS\Altium_Footprint_Lib.PcbLib
R699 = RESISTOR_Dup4: RES 22E 1/16W 1% 0402; Mistral Part No: 110009090004-P; Mfr_name: YAGEO AMERICA; Mfr_part_number: RC0402FR-0722RL; Part_type: RESISTORS\FIXED; Alternate_mfr_name_A: VISHAY; Alternate_mfr_part_number_A: CRCW040222R0FKED; Cust_part_number: 4700-80047E; SIGNAL_MODEL: RESISTOR_RES0402_22E_22E; Project: VMEFMCD; Voltage: 50V; Customs_HS_Code: 85332119; Custom_Duty: 15%; Remarks: In alternate datasheet it is RoHS COMPLIANT. Y:\MIS_DATABASE\DATASHEETS\RESISTORS\CRCW0402.PDF; Tolerance: 1%; Wattage: 1/16W; Package: 0402; Distributor_name: DIGIKEY; Distributor_part_number: 311-22.0LRCT-ND; Distributor_name_A: DIGIKEY; Distributor_part_number_A: 541-22.0LCT-ND; Height: 0.40MM; Weight: 0.8g/1000pcs; Temperature: -55°C+155°C; Datasheet: Y:\MIS_DATABASE\DATASHEETS\RESISTORS\YAGEO-RC0402.PDF; Crtd /date: MAZHAR/090909; Chkd/date: SUHAS/290910; RoHS: Pb-Free; PCB Footprint: RES0402; Library Ref: RESISTOR
RA6 = RESARR_ISO4: RES ARRAY 0E 31mW 0402-4; Part_type: RESISTORS\ARRAY; Mfr_part_number: EXB-N8VR000X; Mfr_name: PANASONIC-ECG; Mistral Part No: 110009030002-R; Tolerance: NA; Project: AXON; NI_MARK: DNI; MECHANICAL 3D STEP FILE: RESA_EXBN8V_0402-4_0-6; Chkd/date: MANIRAJA/161017; Crtd /date: USMAN/190209; Datasheet: Y:\MIS_DATABASE\DATASHEETS\RESISTORS\EXB-X.PDF; Temperature: -55°C+125°C; Weight: 3mg; Height: 0.55MM; Distributor_part_number: Y10000CT-ND; Distributor_name: DIGIKEY; Package: 0402-4; Wattage: 31mW; Voltage: NA; PCB Footprint: RESA_EXBN8V_0402-4_0-6; Library Ref: RESARR_ISO4
RA17 = RESARR_ISO4: RES ARRAY 0E 31mW 0402-4; Mistral Part No: 110009030002-R; Mfr_name: PANASONIC-ECG; Mfr_part_number: EXB-N8VR000X; Part_type: RESISTORS\ARRAY; Tolerance: NA; Project: AXON; MECHANICAL 3D STEP FILE: RESA_EXBN8V_0402-4_0-6; Voltage: NA; Wattage: 31mW; Package: 0402-4; Distributor_name: DIGIKEY; Distributor_part_number: Y10000CT-ND; Height: 0.55MM; Weight: 3mg; Temperature: -55°C+125°C; Datasheet: Y:\MIS_DATABASE\DATASHEETS\RESISTORS\EXB-X.PDF; Crtd /date: USMAN/190209; Chkd/date: MANIRAJA/161017; PCB Footprint: RESA_EXBN8V_0402-4_0-6; Library Ref: RESARR_ISO4
U34 = AM654X_BGA784: IC MAXWELL MICRO CONTROLLER UNIT BGA784; Mistral Part No: 141217100003; Mfr_name: TEXAS INSTRUMENTS; Mfr_part_number: MAXWELL M4_EVM; Part_type: ICS\DIGITAL\MICROCONTROLLER; Project: TI_MAXIE_CPB; Tolerance: NA; Customs_HS_Code: 85423100; Custom_Duty: 15%; PCB Footprint: BGA784_31-49_910X910_1-7; Voltage: NA; Wattage: NA; Package: BGA784; Distributor_name: NA; Distributor_part_number: NA; Height: 1.63MM; Weight: NA; Temperature: NA; Datasheet: Y:\MIS_DATABASE\DATASHEETS\ICS\DIGITAL\MICROCONTROLLER\MAXWELLM4.PDF; Crtd /date: MANIRAJA/130717; Chkd/date: MANIRAJA/130717; MECHANICAL 3D STEP FILE: BGA784_31-49_910X910_1-7; Library Ref: AM654X_BGA784
U100 = TXB0108RGYR_VQFN20: IC 8-BIT TRANSLATOR 15KV ESD VQFN20; Mistral Part No: 141010050005-R; Mfr_name: TEXAS INSTRUMENTS; Part_type: ICS\INTERFACE; Project: SHIVA; Tolerance: NA; Customs_HS_Code: 85423100; Custom_Duty: 15%; Mfr_part_number: TXB0108RGYR; Voltage: NA; Wattage: NA; Package: VQFN20; Distributor_name: DIGIKEY; Distributor_part_number: 296-21528-1-ND; Height: 1.00MM; Weight: 43mg; Temperature: -40°C+85°C; Datasheet: Y:\MIS_DATABASE\DATASHEETS\ICS\INTERFACE\TXB0108RGYR.PDF; Crtd /date: MUDDU/190510; Chkd/date: VASANTHA/221216; RoHS: Sb/ Br FREE; MECHANICAL 3D STEP FILE: QFN20_19-68_185X145_1; PCB Footprint: QFN20_19-68_185X145_1; Library Ref: TXB0108RGYR_VQFN20
U108 = SN74LVC1G08DBVRE4_SOT23-5: IC SINGLE 2-INPUT POSITIVE AND GATE SOT23-5; Mistral Part No: 141009060026-R; Mfr_name: TEXAS INSTRUMENTS; Part_type: ICS\DIGITAL\GATES; Project: KHAN_MAIN; Customs_HS_Code: 85423100; Custom_Duty: 15%; Mfr_part_number: SN74LVC1G08DBVRE4; Package: SOT23-5; Distributor_name: DIGIKEY; Distributor_part_number: SN74LVC1G08DBVRE4-ND; Height: 1.45MM; Temperature: -40°C+85°C; Datasheet: Y:\MIS_DATABASE\DATASHEETS\ICS\DIGITAL\GATES\SN74LVC1G08.PDF; Crtd /date: USMAN/151008; Chkd/date: SUHAS/221010; RoHS: Sb/ Br FREE; PCB Footprint: SOT23-5; Library Ref: SN74LVC1G08DBVRE4_SOT23-5
U111 = TXS0108ERGYR_QFN20: IC TRANSLATOR BIDIRECTIONAL VOLTAGE-LEVEL 8BIT QFN20; Mistral Part No: 141011040019-R; Mfr_name: TEXAS INSTRUMENTS; Part_type: ICS\INTERFACE; Project: OMAPL1_PEC20; Tolerance: NA; Customs_HS_Code: 85423100; Custom_Duty: 15%; Mfr_part_number: TXS0108ERGYR; Voltage: NA; Wattage: NA; Package: QFN20; Distributor_name: DIGIKEY; Distributor_part_number: 296-24806-1-ND; Height: 1.00MM; Weight: 43mg; Temperature: -40°C+85°C; Datasheet: Y:\MIS_DATABASE\DATASHEETS\ICS\INTERFACE\TXS0108E.PDF; Crtd /date: BAVISH/280411; Chkd/date: VASANTHA/060117; MECHANICAL 3D STEP FILE: QFN20_19-68_185X145_1; PCB Footprint: QFN20_19-68_185X145_1; Library Ref: TXS0108ERGYR_QFN20
U112 U114 = OSC_KC2520B: OSC 24MHz 1.8V SMD; Mistral Part No: 130015030022-R; Mfr_name: KYOCERA; Mfr_part_number: KC2520B24.0000C1GE00; Part_type: OSCILLATORS; Project: DLRL; Tolerance: NA; Customs_HS_Code: 85437099; Custom_Duty: 24%; Voltage: NA; Wattage: NA; Package: SMD; Distributor_name: DIGIKEY; Distributor_part_number: 1253-1244-1-ND; Height: 0.70MM; Weight: NA; Temperature: -40°C+85°C; Datasheet: Y:\MIS_DATABASE\DATASHEETS\MISC\CRY_OSC\KC2520B2.PDF; Crtd /date: JEBRAN/310315; Chkd/date: NAVEED/080415; PCB Footprint: OSC4_KC2520B_100X80_SMD; Library Ref: OSC_KC2520B